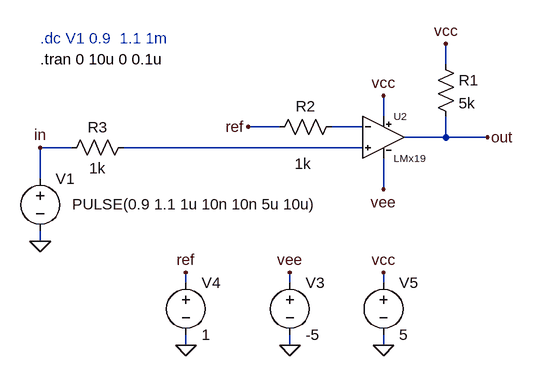
[diagram p0: schematic LM319_ST_test.asc]
LM319_ST_test.asc, the LTspice schematic file:
Version 4.1
SHEET 1 3840 2428
WIRE 304 -256 304 -288
WIRE 208 -176 208 -208
WIRE 48 -160 0 -160
WIRE 176 -160 128 -160
WIRE 304 -144 304 -176
WIRE 304 -144 240 -144
WIRE 368 -144 304 -144
WIRE -272 -128 -320 -128
WIRE 176 -128 -192 -128
WIRE -320 -80 -320 -128
WIRE 208 -64 208 -112
WIRE -320 16 -320 0
WIRE -96 80 -96 64
WIRE 64 80 64 64
WIRE 208 80 208 64
WIRE -96 176 -96 160
WIRE 64 176 64 160
WIRE 208 176 208 160
FLAG 64 176 0
FLAG -320 16 0
FLAG 368 -144 out
FLAG -96 176 0
FLAG -320 -128 in
FLAG 208 -64 vee
FLAG -96 64 ref
FLAG 208 -208 vcc
FLAG 64 64 vee
FLAG 304 -288 vcc
FLAG 208 176 0
FLAG 208 64 vcc
FLAG 0 -160 ref
SYMBOL voltage 64 64 R0
SYMATTR InstName V3
SYMATTR Value -5
SYMBOL res 288 -272 R0
SYMATTR InstName R1
SYMATTR Value 5k
SYMBOL res 144 -176 R90
WINDOW 0 0 56 VBottom 2
WINDOW 3 57 60 VTop 2
SYMATTR InstName R2
SYMATTR Value 1k
SYMBOL res -288 -112 R270
WINDOW 0 32 56 VTop 2
WINDOW 3 0 56 VBottom 2
SYMATTR InstName R3
SYMATTR Value 1k
SYMBOL voltage -320 -96 R0
WINDOW 123 0 0 Left 2
WINDOW 39 0 0 Left 2
WINDOW 3 49 55 Left 2
SYMATTR Value PULSE(0.9 1.1 1u 10n 10n 5u 10u)
SYMATTR InstName V1
SYMBOL voltage -96 64 R0
SYMATTR InstName V4
SYMATTR Value 1
SYMBOL voltage 208 64 R0
SYMATTR InstName V5
SYMATTR Value 5
SYMBOL ZmySymbol\\Comperators\\LM319 208 -208 R0
SYMATTR InstName U2
TEXT -320 -296 Left 2 ;.dc V1 0.9  1.1 1m
TEXT -320 -264 Left 2 !.tran 0 10u 0 0.1u

The netlist it stands for:
* LM319_ST_test.asc
V3 vee 0 -5
R1 vcc out 5k
R2 N001 ref 1k
R3 in N002 1k
V1 in 0 PULSE(0.9 1.1 1u 10n 10n 5u 10u)
V4 ref 0 1
V5 vcc 0 5
X§U2 N002 N001 vcc vee out LMx19  ; pins In+ In- V+ V- OUT
* .dc V1 0.9  1.1 1m
.tran 0 10u 0 0.1u
.lib LMx19.lib
.backanno
.end